# Altium schematic sheet 07_HDMI.SchDoc: HMDI
size 420 x 297 mm; Author: T. Ludemann; SheetNumber: 7; SheetTotal: 8; DocSize: DINA3
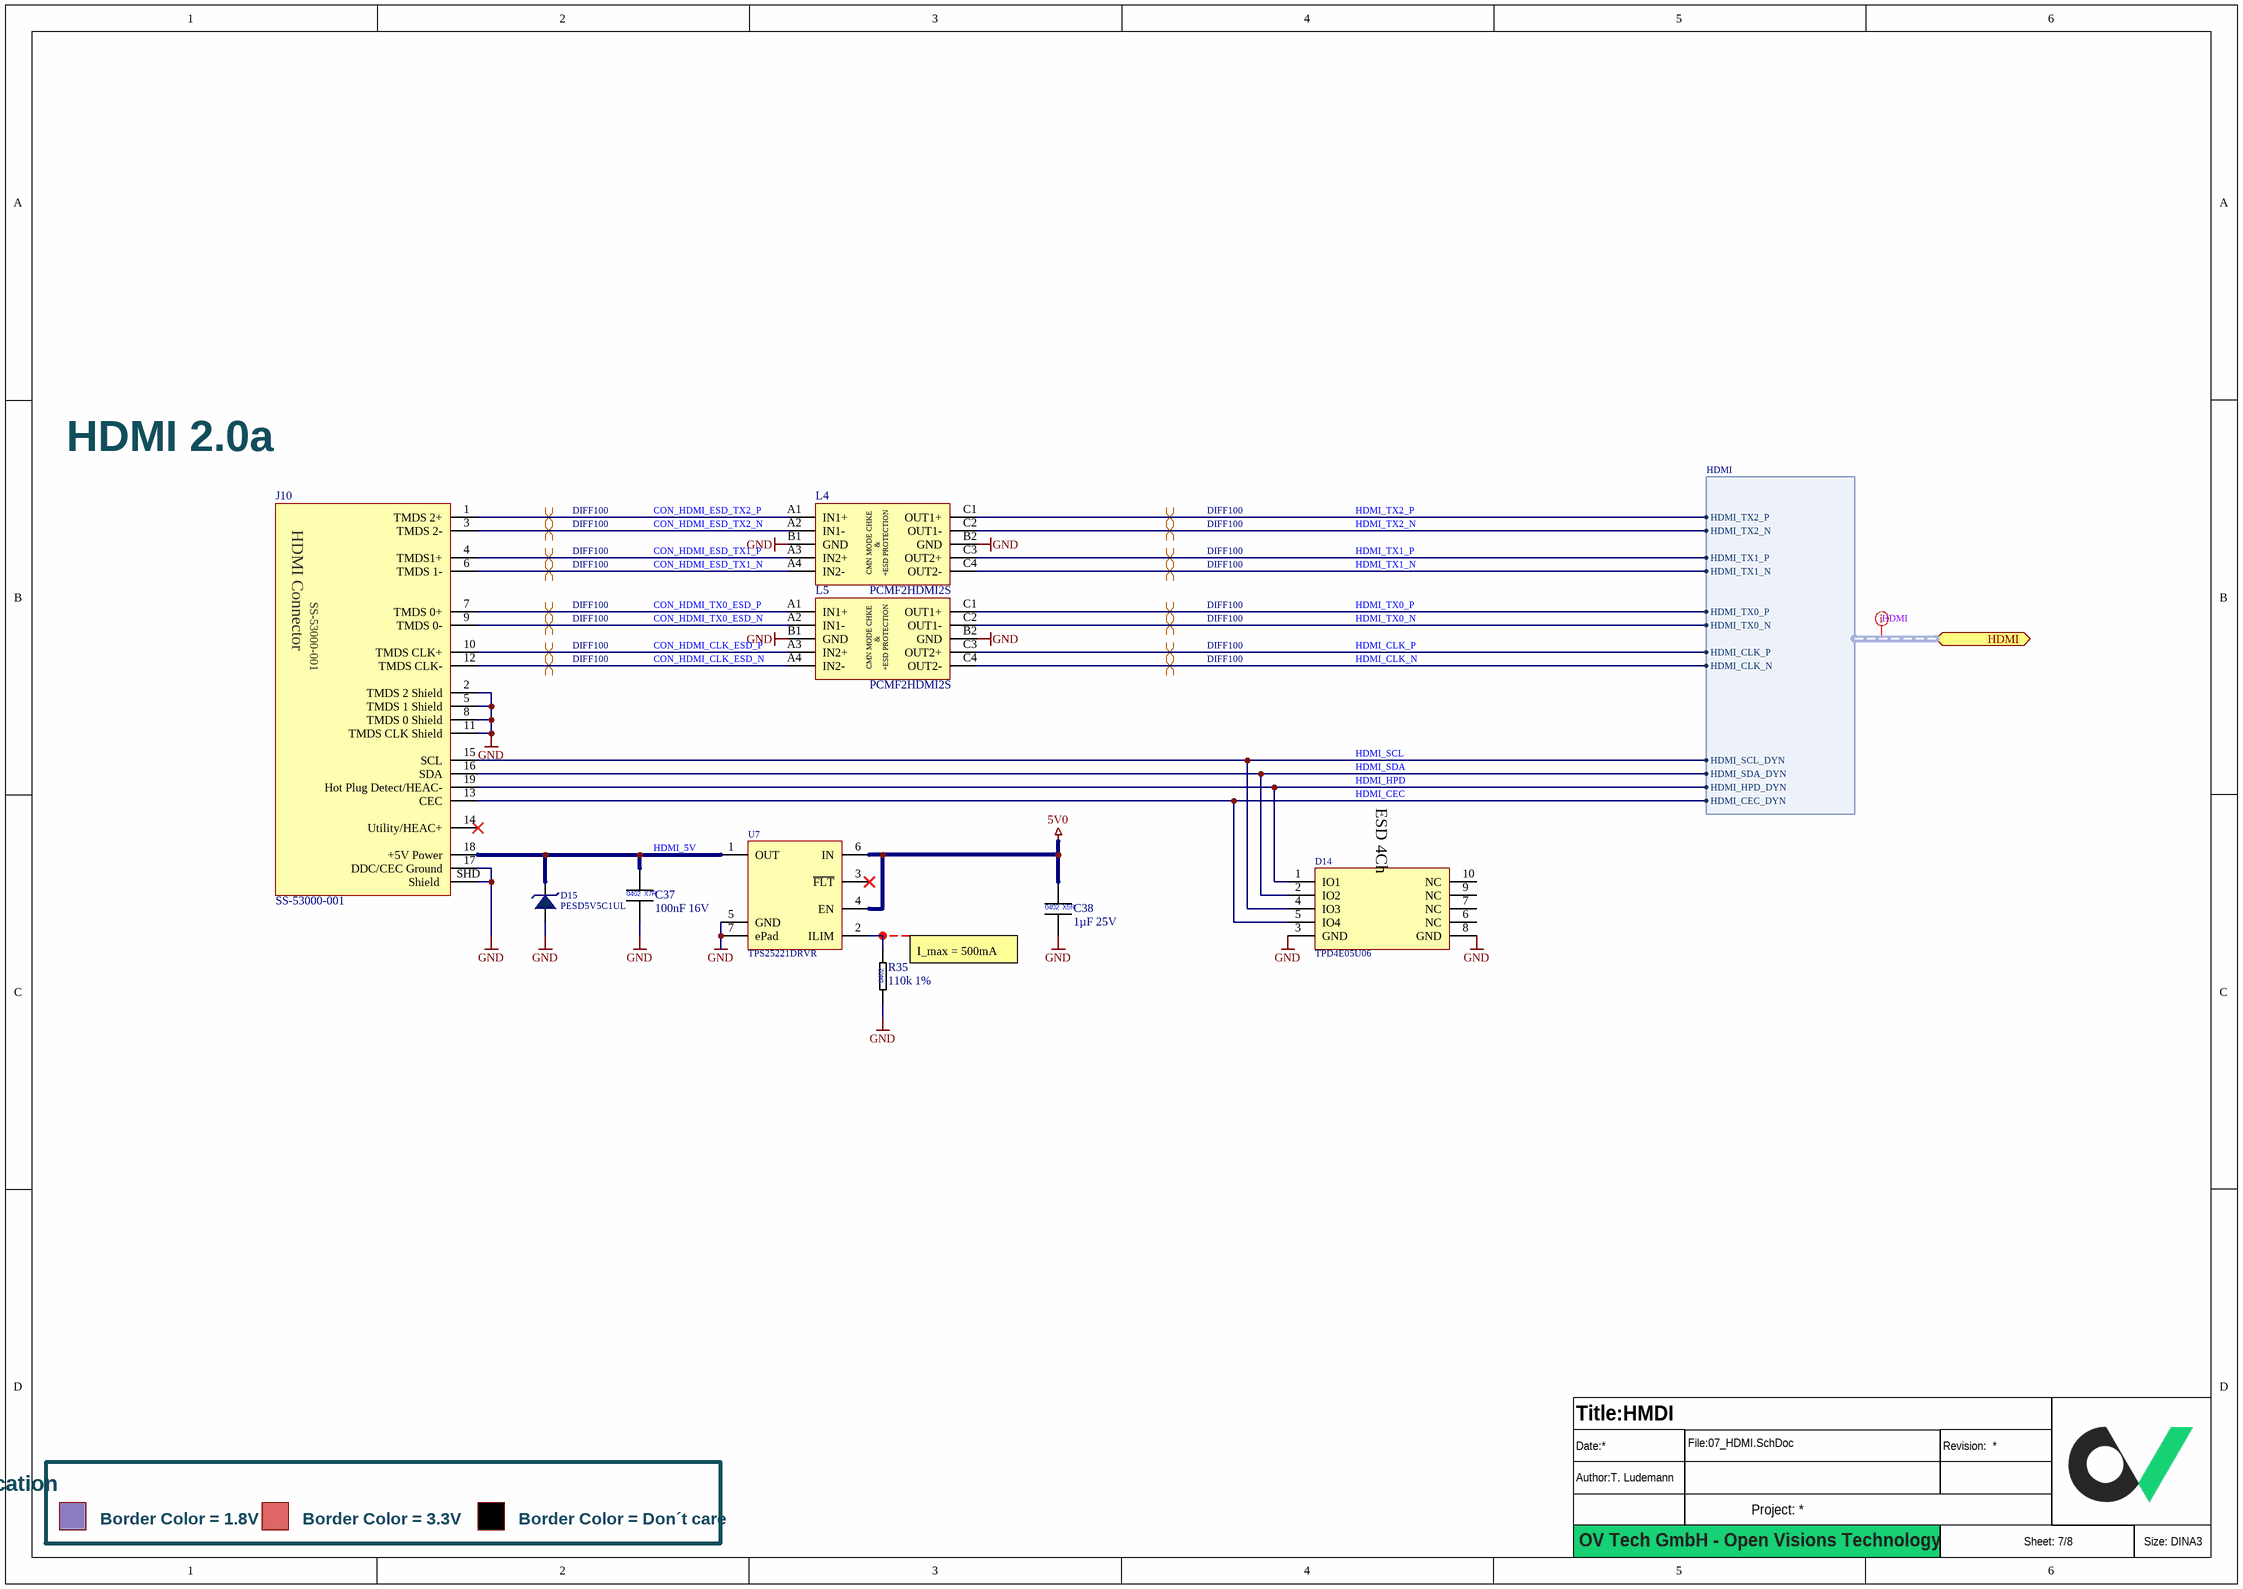
[diagram p0: 07_HDMI.SchDoc]

## Parts
?  (no value)  (graphical)
C37  100nF 16V  [CAPC1005X06L]
C38  1µF 25V  [CAPC1005X06L]
D14  TPD4E05U06  [TI_DQA_10_Pin]
D15  PESD5V5C1UL  [DFN65P100X50-2N]
J10  SS-53000-001  [HDMI-1.4_SS-53000-001]
L4  PCMF2HDMI2S  [Nexperia_PCMF2HDMI2S]
L5  PCMF2HDMI2S  [Nexperia_PCMF2HDMI2S]
R35  110k 1%  [RESC1005X04L]
U7  TPS25221DRVR  [SON65P200X80_HS-7N]

## Ports
HDMI (bidir, harness HDMI)

## Harnesses
HDMI: HDMI_SCL_DYN, HDMI_SDA_DYN, HDMI_HPD_DYN, HDMI_CEC_DYN, HDMI_CLK_N, HDMI_CLK_P, HDMI_TX0_N, HDMI_TX0_P, HDMI_TX1_N, HDMI_TX1_P, HDMI_TX2_N, HDMI_TX2_P

## Nets
5V0: C38.1 U7.4(EN) U7.6(IN)
GND: C37.2 C38.2 D14.3(GND) D14.8(GND) D15.2 J10.2(TMDS_2_Shield) J10.5(TMDS_1_Shield) J10.8(TMDS_0_Shield) J10.11(TMDS_CLK_Shield) J10.17(DDC/CEC_Ground) J10.SHD(Shield) L4.B1(GND) L4.B2(GND) L5.B1(GND) L5.B2(GND) R35.1 U7.5(GND) U7.7(ePad)
CON_HDMI_CLK_ESD_N: J10.12(TMDS_CLK-) L5.A4(IN2-)
CON_HDMI_CLK_ESD_P: J10.10(TMDS_CLK+) L5.A3(IN2+)
CON_HDMI_ESD_TX1_N: J10.6(TMDS_1-) L4.A4(IN2-)
CON_HDMI_ESD_TX1_P: J10.4(TMDS1+) L4.A3(IN2+)
CON_HDMI_ESD_TX2_N: J10.3(TMDS_2-) L4.A2(IN1-)
CON_HDMI_ESD_TX2_P: J10.1(TMDS_2+) L4.A1(IN1+)
CON_HDMI_TX0_ESD_N: J10.9(TMDS_0-) L5.A2(IN1-)
CON_HDMI_TX0_ESD_P: J10.7(TMDS_0+) L5.A1(IN1+)
HDMI_5V: C37.1 D15.1 J10.18(+5V_Power) U7.1(OUT)
HDMI_CEC: D14.5(IO4) J10.13(CEC) ; port HDMI.HDMI_CEC_DYN
HDMI_CLK_N: L5.C4(OUT2-) ; port HDMI.HDMI_CLK_N
HDMI_CLK_P: L5.C3(OUT2+) ; port HDMI.HDMI_CLK_P
HDMI_HPD: D14.1(IO1) J10.19(Hot_Plug_Detect/HEAC-) ; port HDMI.HDMI_HPD_DYN
HDMI_SCL: D14.4(IO3) J10.15(SCL) ; port HDMI.HDMI_SCL_DYN
HDMI_SDA: D14.2(IO2) J10.16(SDA) ; port HDMI.HDMI_SDA_DYN
HDMI_TX0_N: L5.C2(OUT1-) ; port HDMI.HDMI_TX0_N
HDMI_TX0_P: L5.C1(OUT1+) ; port HDMI.HDMI_TX0_P
HDMI_TX1_N: L4.C4(OUT2-) ; port HDMI.HDMI_TX1_N
HDMI_TX1_P: L4.C3(OUT2+) ; port HDMI.HDMI_TX1_P
HDMI_TX2_N: L4.C2(OUT1-) ; port HDMI.HDMI_TX2_N
HDMI_TX2_P: L4.C1(OUT1+) ; port HDMI.HDMI_TX2_P
NetR35_2: R35.2 U7.2(ILIM)

Not connected (* = marked no-connect by the designer): D14 6(NC) 7(NC) 9(NC) 10(NC); J10 14(Utility/HEAC+)*; U7 3(~{FLT})*

## Layout directives
net class HDMI: (no net found under the mark)
differential pair; differential pair class DIFF100: CON_HDMI_CLK_ESD_N, CON_HDMI_CLK_ESD_P, CON_HDMI_ESD_TX1_N, CON_HDMI_ESD_TX1_P, CON_HDMI_ESD_TX2_N, CON_HDMI_ESD_TX2_P, CON_HDMI_TX0_ESD_N, CON_HDMI_TX0_ESD_P, HDMI_CLK_N, HDMI_CLK_P, HDMI_TX0_N, HDMI_TX0_P, HDMI_TX1_N, HDMI_TX1_P, HDMI_TX2_N, HDMI_TX2_P

## Notes on the sheet
- HDMI 2.0a
- (near R35) I_max = 500mA
- Signal Level Indication
- Border Color = 1.8V
- Border Color = 3.3V
- Border Color = Don´t care
- OV Tech GmbH - Open Visions Technology
- (in symbol CAP_0402_1µ_25V) 0402; X5R
- (in symbol CAP_0402_100nF_16V) 0402; X7R
- (in symbol Common Mode Choke 2 Channel with ESD prot_PCMF2HDMI2S) &; CMN MODE CHKE; +ESD PROTECTION
- (in symbol ESD_HI-SPEED_ARRAY_TPD4E05U06) ESD 4Ch
- (in symbol HDMI Receptacle_SS-53000-001) HDMI Connector
- (in symbol RES_0402_110k_1%) 0402

## Library data of the parts
? = Titleblock_01_OpenSource
C37 = CAP_0402_100nF_16V: Multilayer Ceramic Capacitors MLCC - SMD/SMT 0402 16VDC; Manufacturer 1: KYOCERA AVX; Manufacturer 1 Prt. Nr.: KGM05AR71C104KH; Manufacturer 2 Prt. Nr.: EMK105B7104KV-F; Manufacturer 2: Taiyo Yuden
C38 = CAP_0402_1µ_25V: Multilayer Ceramic Capacitors MLCC - SMD/SMT 0402 25VDC; Manufacturer 1: Murata Electronics; Manufacturer 1 Prt. Nr.: GRM155R61E105KE11D; Manufacturer 2 Prt. Nr.: 0402X105K250CT; Manufacturer 2: Walsin
D14 = ESD_HI-SPEED_ARRAY_TPD4E05U06: PDxE05U06 1, 4, 6 Channel ESD Protection Device for Super-Speed (Up to 6 Gbps) Interface; Manufacturer 1: Texas Instruments; Manufacturer 1 Prt. Nr.: TPD4E05U06
D15 = ESD 5.5V_PESD5V5C1UL: ESD Diode 5.5V working voltage DFN1006-2; Manufacturer 1: Nexperia; Manufacturer 1 Prt. Nr.: PESD5V5C1UL
J10 = HDMI Receptacle_SS-53000-001: CONN RCPT HDMI 1.4 R/A NO FLANGE; Manufacturer 1: Stewart Connector; Manufacturer 1 Prt. Nr.: SS-53000-001
L4 L5 = Common Mode Choke 2 Channel with ESD prot_PCMF2HDMI2S: Common-mode EMI filter for differential channels with / integrated ESD protection; Manufacturer 1: Nexperia; Manufacturer 1 Prt. Nr.: PCMF2HDMI2S
R35 = RES_0402_110k_1%: Thick Film Resistors - SMD 110k 1%; Manufacturer 1: Würth Elektronik; Manufacturer 1 Prt. Nr.: 560112110186; Manufacturer 2 Prt. Nr.: CR0402-FX-1103GLF; Manufacturer 2: Bourns
U7 = Power Switch with programmable current limit TPS25221DRVR: 0.275-2.7A adj. ILIMIT, 2.5-5.5V, 70mΩ USB power switch, active-high, reverse blocking; Manufacturer 1: Texas Instruments; Manufacturer 1 Prt. Nr.: TPS25221DRVR